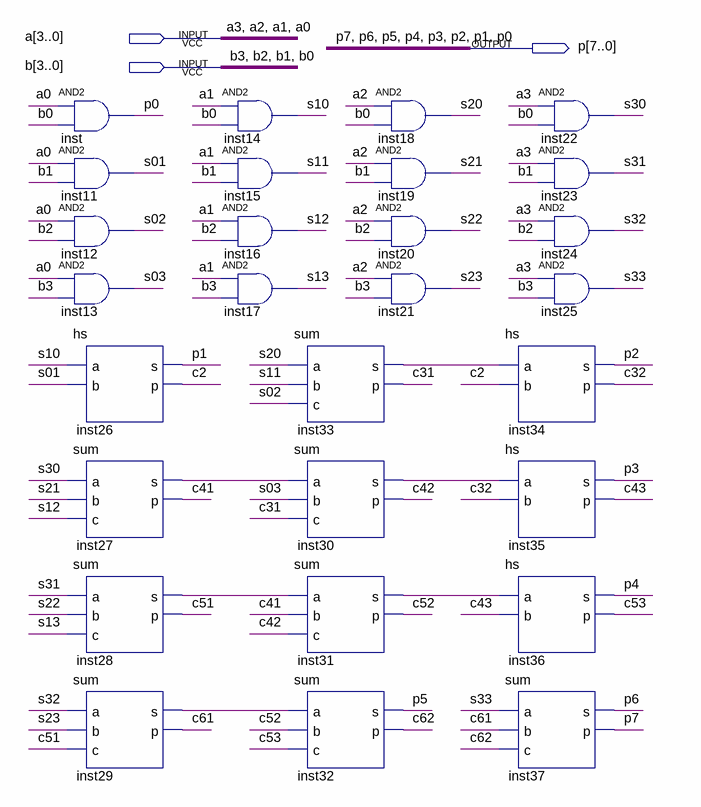
[diagram p0: schematic sheet]
// Quartus schematic s29_mul.bdf as structural Verilog: 28 symbols, 3 pins
module s29_mul (
  input  [3:0] a,
  input  [3:0] b,
  output [7:0] p
);

  wire c2, c31, c32, c41, c42, c43, c51, c52, c53, c61, c62, inst27_s, inst28_s, inst29_s, inst30_s,
       inst31_s, inst33_s, s01, s02, s03, s10, s11, s12, s13, s20, s21, s22, s23, s30, s31, s32, s33;

  and inst (p[0], a[0], b[0]);
  and inst11 (s01, a[0], b[1]);
  and inst12 (s02, a[0], b[2]);
  and inst13 (s03, a[0], b[3]);
  hs inst26 (.a(s10), .b(s01), .s(p[1]), .p(c2));
  sum inst27 (.a(s30), .b(s21), .c(s12), .s(inst27_s), .p(c41));
  sum inst28 (.a(s31), .b(s22), .c(s13), .s(inst28_s), .p(c51));
  sum inst29 (.a(s32), .b(s23), .c(c51), .s(inst29_s), .p(c61));
  and inst14 (s10, a[1], b[0]);
  and inst15 (s11, a[1], b[1]);
  and inst16 (s12, a[1], b[2]);
  and inst17 (s13, a[1], b[3]);
  sum inst33 (.a(s20), .b(s11), .c(s02), .s(inst33_s), .p(c31));
  sum inst30 (.a(inst27_s), .b(s03), .c(c31), .s(inst30_s), .p(c42));
  sum inst31 (.a(inst28_s), .b(c41), .c(c42), .s(inst31_s), .p(c52));
  sum inst32 (.a(inst29_s), .b(c52), .c(c53), .s(p[5]), .p(c62));
  and inst18 (s20, a[2], b[0]);
  and inst19 (s21, a[2], b[1]);
  and inst20 (s22, a[2], b[2]);
  and inst21 (s23, a[2], b[3]);
  and inst22 (s30, a[3], b[0]);
  and inst23 (s31, a[3], b[1]);
  and inst24 (s32, a[3], b[2]);
  and inst25 (s33, a[3], b[3]);
  hs inst34 (.a(inst33_s), .b(c2), .s(p[2]), .p(c32));
  hs inst35 (.a(inst30_s), .b(c32), .s(p[3]), .p(c43));
  hs inst36 (.a(inst31_s), .b(c43), .s(p[4]), .p(c53));
  sum inst37 (.a(s33), .b(c61), .c(c62), .s(p[6]), .p(p[7]));
endmodule
